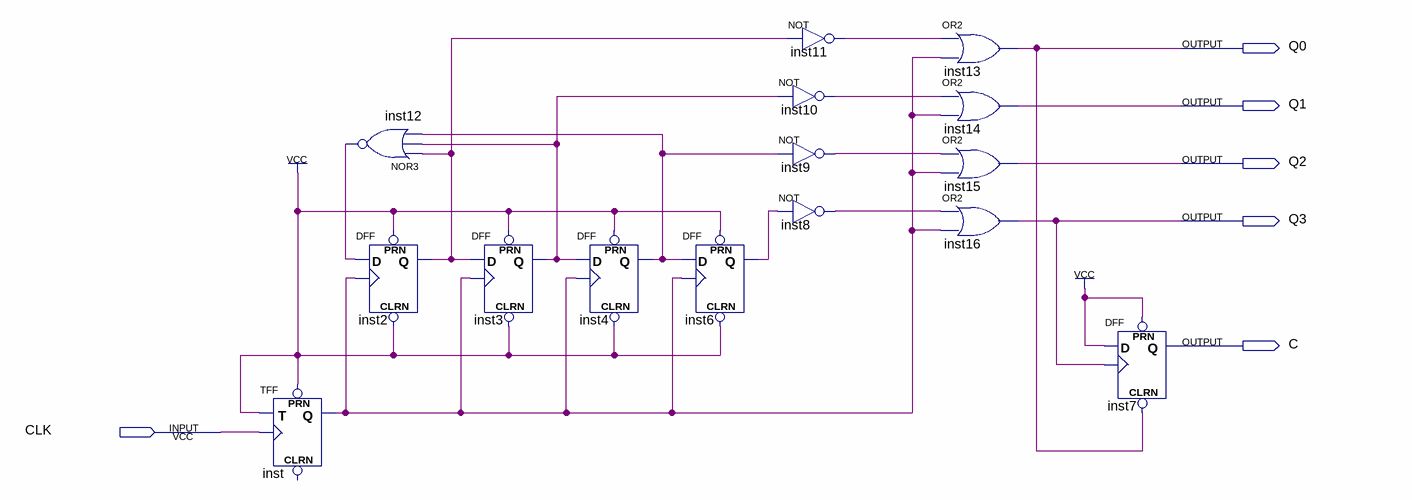
[diagram p0: schematic sheet]
// Quartus schematic signal.bdf as structural Verilog: 15 symbols, 6 pins
module signal (
  input  CLK,
  output Q0,
  output Q1,
  output Q2,
  output Q3,
  output C
);

  wire inst2_q, inst3_q, inst4_q, inst6_q, inst8_out, inst9_out, inst10_out, inst11_out, inst12_out, inst_q;

  TFF inst (.PRN(1'b1), .T(1'b1), .CLK(CLK), .Q(inst_q));  // open: CLRN
  nor inst12 (inst12_out, inst2_q, inst3_q, inst4_q);
  DFF inst2 (.CLRN(1'b1), .CLK(inst_q), .D(inst12_out), .PRN(1'b1), .Q(inst2_q));
  DFF inst3 (.CLRN(1'b1), .CLK(inst_q), .D(inst2_q), .PRN(1'b1), .Q(inst3_q));
  DFF inst4 (.CLRN(1'b1), .CLK(inst_q), .D(inst3_q), .PRN(1'b1), .Q(inst4_q));
  DFF inst6 (.CLRN(1'b1), .CLK(inst_q), .D(inst4_q), .PRN(1'b1), .Q(inst6_q));
  not inst11 (inst11_out, inst2_q);
  not inst10 (inst10_out, inst3_q);
  not inst9 (inst9_out, inst4_q);
  not inst8 (inst8_out, inst6_q);
  or inst13 (Q0, inst11_out, inst_q);
  or inst14 (Q1, inst10_out, inst_q);
  or inst15 (Q2, inst9_out, inst_q);
  or inst16 (Q3, inst8_out, inst_q);
  DFF inst7 (.CLRN(Q0), .CLK(Q3), .D(1'b1), .PRN(1'b1), .Q(C));
endmodule
